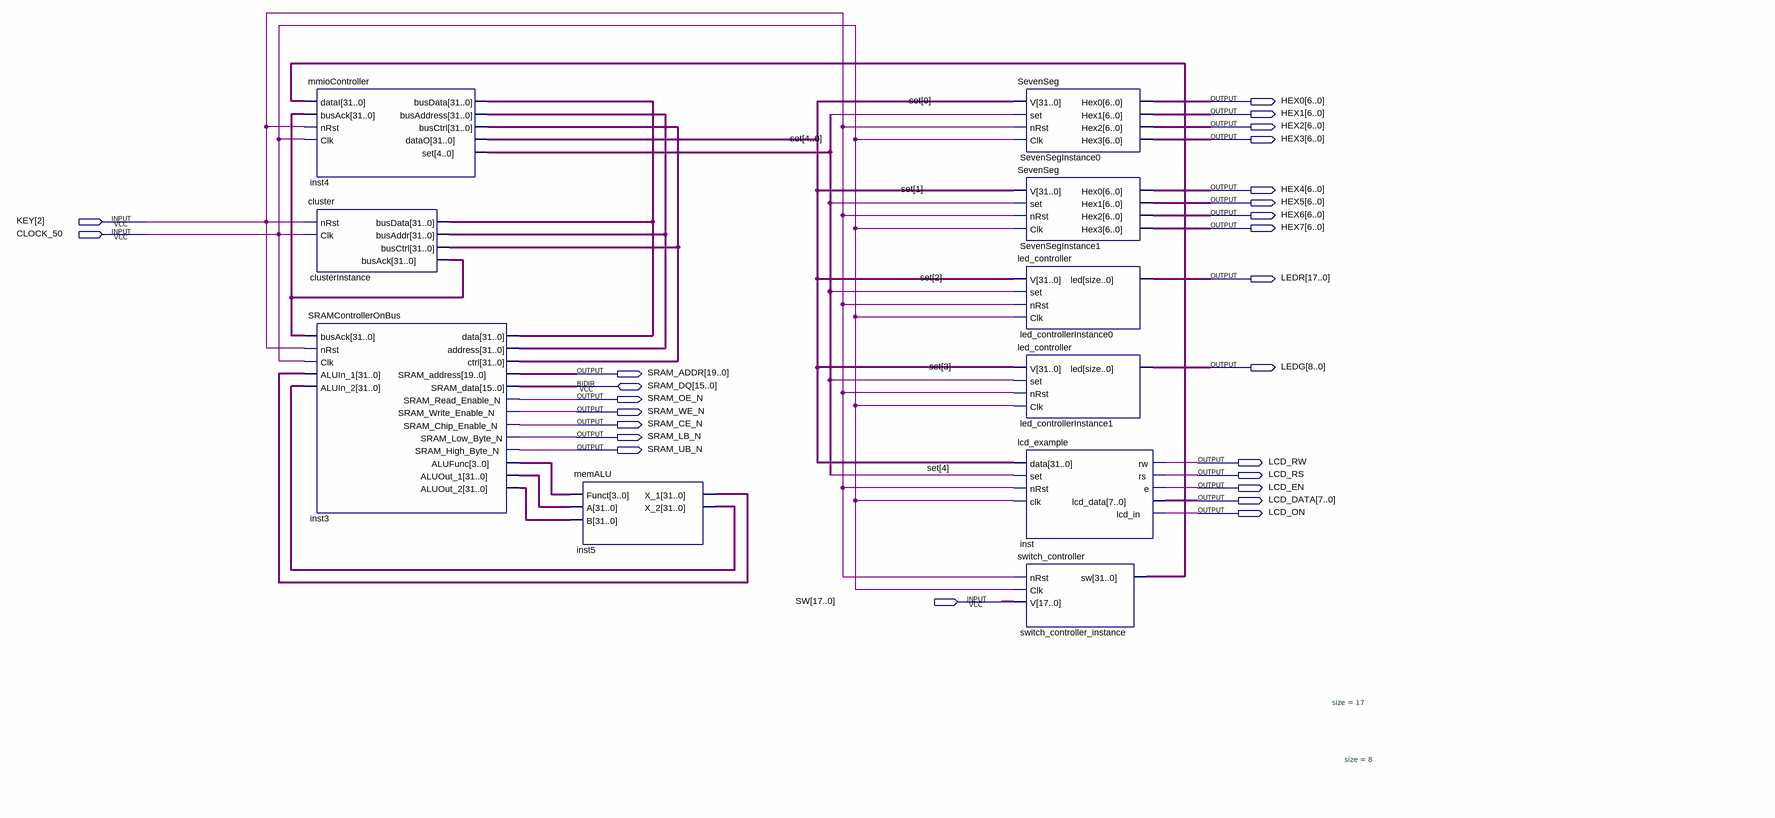
[diagram p0: schematic sheet]
// Quartus schematic multicore.bdf as structural Verilog: 10 symbols, 25 pins
module multicore (
  input  [2:2] KEY,
  input  CLOCK_50,
  input  [17:0] SW,
  inout  [15:0] SRAM_DQ,
  output [6:0] HEX0,
  output [6:0] HEX1,
  output [6:0] HEX2,
  output [6:0] HEX3,
  output [6:0] HEX4,
  output [6:0] HEX5,
  output [6:0] HEX6,
  output [6:0] HEX7,
  output [17:0] LEDR,
  output [8:0] LEDG,
  output [19:0] SRAM_ADDR,
  output SRAM_OE_N,
  output SRAM_WE_N,
  output SRAM_CE_N,
  output SRAM_LB_N,
  output SRAM_UB_N,
  output LCD_RW,
  output LCD_RS,
  output LCD_EN,
  output [7:0] LCD_DATA,
  output LCD_ON
);

  wire [3:0] inst3_alufunc;
  wire [4:0] set;
  wire [31:0] clusterInstance_busack, inst3_aluout_1, inst3_aluout_2, inst4_busaddress, inst4_busctrl,
       inst4_busdata, inst4_datao, inst5_x_1, inst5_x_2, switch_controller_instance_sw;

  mmioController inst4 (
    .dataI(switch_controller_instance_sw), .busAck(clusterInstance_busack), .nRst(KEY[2]), .Clk(CLOCK_50),
    .dataO(inst4_datao), .set(set), .busData(inst4_busdata), .busAddress(inst4_busaddress),
    .busCtrl(inst4_busctrl));
  cluster clusterInstance (
    .nRst(KEY[2]), .Clk(CLOCK_50), .busAck(clusterInstance_busack), .busData(inst4_busdata),
    .busAddr(inst4_busaddress), .busCtrl(inst4_busctrl));
  SRAMControllerOnBus inst3 (
    .busAck(clusterInstance_busack), .nRst(KEY[2]), .Clk(CLOCK_50), .ALUIn_1(inst5_x_1), .ALUIn_2(inst5_x_2),
    .SRAM_address(SRAM_ADDR), .SRAM_Read_Enable_N(SRAM_OE_N), .SRAM_Write_Enable_N(SRAM_WE_N),
    .SRAM_Chip_Enable_N(SRAM_CE_N), .SRAM_Low_Byte_N(SRAM_LB_N), .SRAM_High_Byte_N(SRAM_UB_N),
    .ALUFunc(inst3_alufunc), .ALUOut_1(inst3_aluout_1), .ALUOut_2(inst3_aluout_2), .data(inst4_busdata),
    .address(inst4_busaddress), .ctrl(inst4_busctrl), .SRAM_data(SRAM_DQ));
  memALU inst5 (.Funct(inst3_alufunc), .A(inst3_aluout_1), .B(inst3_aluout_2), .X_1(inst5_x_1), .X_2(inst5_x_2));
  SevenSeg SevenSegInstance0 (
    .V(inst4_datao), .set(set[0]), .nRst(KEY[2]), .Clk(CLOCK_50), .Hex0(HEX0), .Hex1(HEX1), .Hex2(HEX2),
    .Hex3(HEX3));
  SevenSeg SevenSegInstance1 (
    .V(inst4_datao), .set(set[1]), .nRst(KEY[2]), .Clk(CLOCK_50), .Hex0(HEX4), .Hex1(HEX5), .Hex2(HEX6),
    .Hex3(HEX7));
  led_controller #(.size(17)) led_controllerInstance0 (
    .V(inst4_datao), .set(set[2]), .nRst(KEY[2]), .Clk(CLOCK_50), .led(LEDR));
  led_controller #(.size(8)) led_controllerInstance1 (
    .V(inst4_datao), .set(set[3]), .nRst(KEY[2]), .Clk(CLOCK_50), .led(LEDG));
  lcd_example inst (
    .data(inst4_datao), .set(set[4]), .nRst(KEY[2]), .clk(CLOCK_50), .rw(LCD_RW), .rs(LCD_RS), .e(LCD_EN),
    .lcd_data(LCD_DATA), .lcd_in(LCD_ON));
  switch_controller switch_controller_instance (
    .nRst(KEY[2]), .Clk(CLOCK_50), .V(SW), .sw(switch_controller_instance_sw));
endmodule
